# EAGLE design absolute_position (EAGLE 6.5.0)
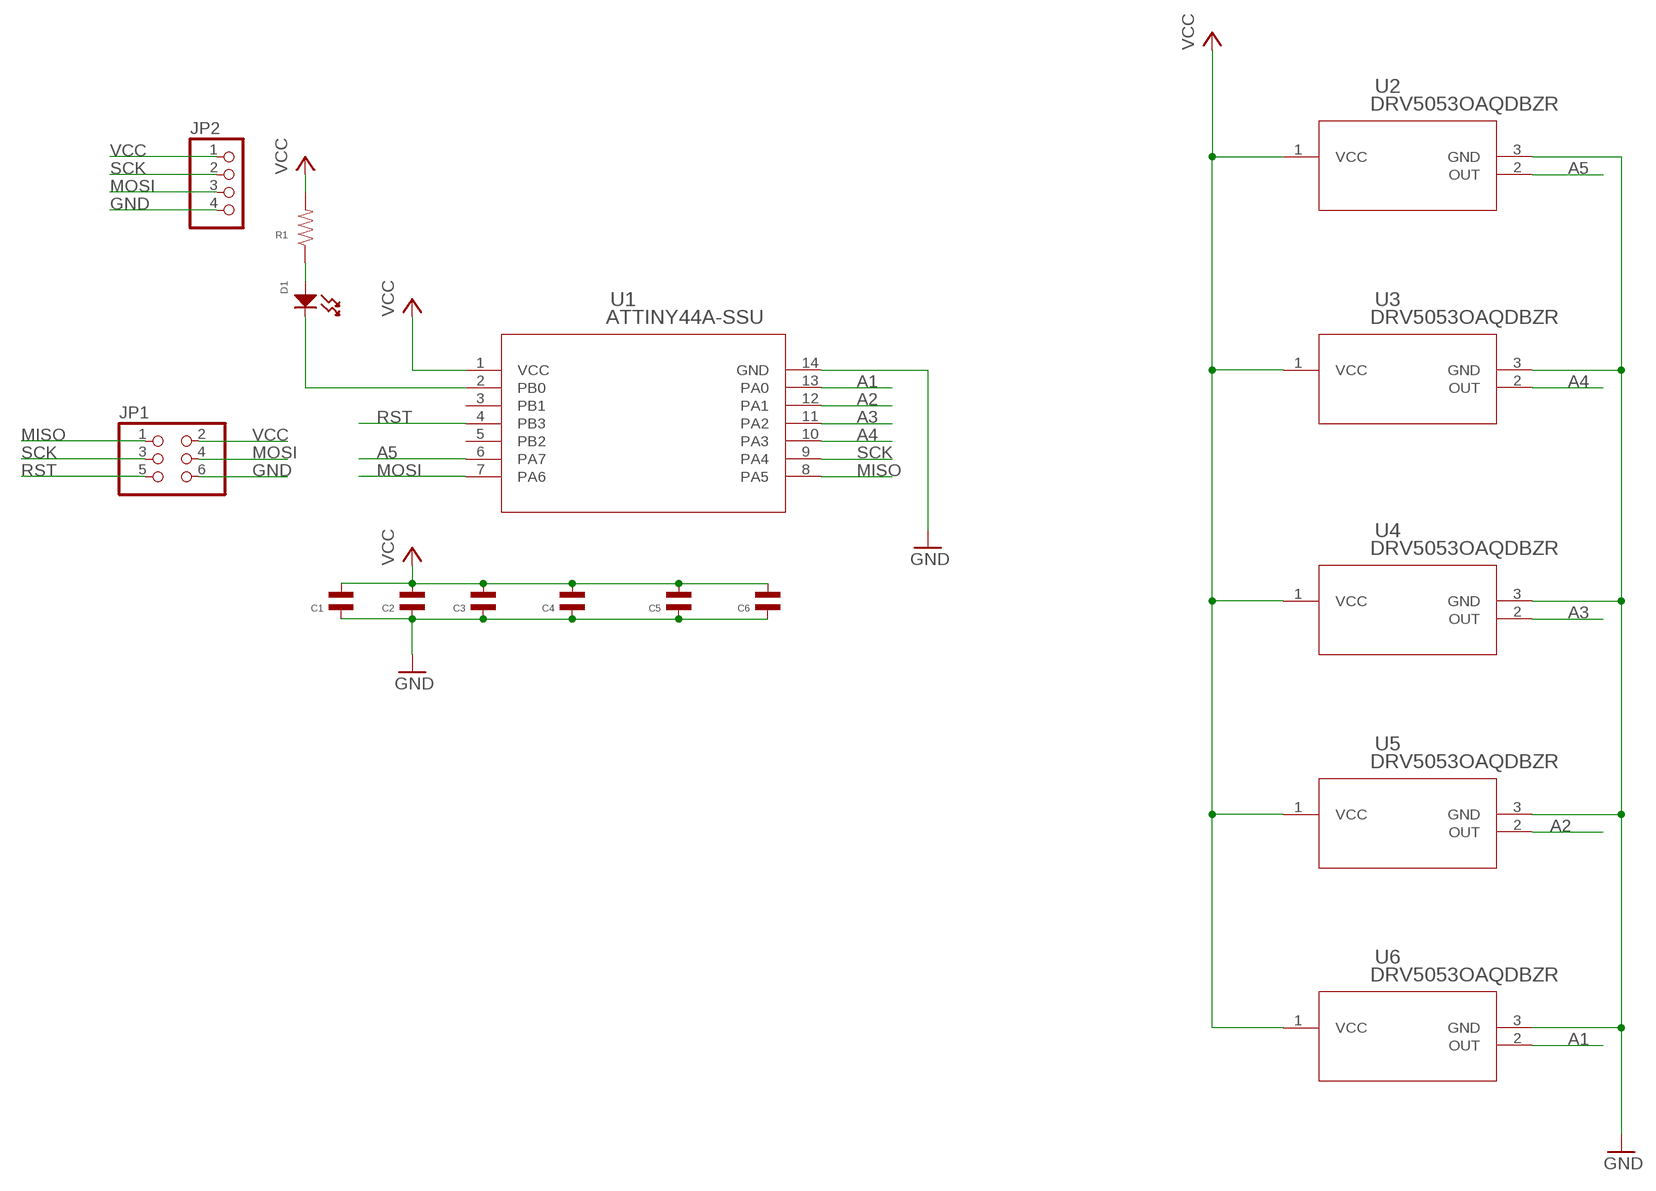
[diagram p0: schematic, sheet 1]

## Parts
C1  CAPACITOR_NP_0603  [C0603]
C2  CAPACITOR_NP_0603  [C0603]
C3  CAPACITOR_NP_0603  [C0603]
C4  CAPACITOR_NP_0603  [C0603]
C5  CAPACITOR_NP_0603  [C0603]
C6  CAPACITOR_NP_0603  [C0603]
D1  LED_SINGLE-0603  [LED0603]
JP1  PINHD-2X3  [2X03]
JP2  PINHD-1X4  [1X04]
R1  RESISTOR_0603  [R0603]
U1  ATTINY44A-SSU  [14S1]
U2  DRV5053OAQDBZR  [DBZ3]
U3  DRV5053OAQDBZR  [DBZ3]
U4  DRV5053OAQDBZR  [DBZ3]
U5  DRV5053OAQDBZR  [DBZ3]
U6  DRV5053OAQDBZR  [DBZ3]

## Nets
A1: U1.13(PA0) U6.2(OUT)
A2: U1.12(PA1) U5.2(OUT)
A3: U1.11(PA2) U4.2(OUT)
A4: U1.10(PA3) U3.2(OUT)
A5: U1.6(PA7) U2.2(OUT)
GND: C1.P$1 C2.P$1 C3.P$1 C4.P$1 C5.P$1 C6.P$1 JP1.6 JP2.4 U1.14(GND) U2.3(GND) U3.3(GND) U4.3(GND) U5.3(GND) U6.3(GND)
MISO: JP1.1 U1.8(PA5)
MOSI: JP1.4 JP2.3 U1.7(PA6)
N$1: D1.ANODE R1.P$1
N$2: D1.CATHODE U1.2(PB0)
RST: JP1.5 U1.4(PB3)
SCK: JP1.3 JP2.2 U1.9(PA4)
VCC: C1.P$2 C2.P$2 C3.P$2 C4.P$2 C5.P$2 C6.P$2 JP1.2 JP2.1 R1.P$2 U1.1(VCC) U2.1(VCC) U3.1(VCC) U4.1(VCC) U5.1(VCC) U6.1(VCC)
Unconnected: U1.3(PB1) U1.5(PB2)

## Library data of the parts
C1-C6 = mfpassives:CAPACITOR_NP: Library: MF_Passives Description: Device for Non-Polarized Capacitors. Manufacture part number (MPN) can be added via Attributes. Check https://factory.macrofab.com/parts for the house parts list.; POPULATE: 1
D1 = mfleds:LED_SINGLE: Library: MF_LEDs Description: Device for Single LED Packages. Manufacture part number (MFG#) can be added via Attributes.; HOUSEPART: NO; POPULATE: 1
JP1 = pinhead:PINHD-2X3: PIN HEADER
JP2 = pinhead:PINHD-1X4: PIN HEADER
R1 = mfpassives:RESISTOR: Library: MF_Passives Description: Device for Resistors. Manufacture part number (MPN), Voltage, Tolerance, and Wattage Rating can be added via Attributes. Check https://factory.macrofab.com/parts for the house parts list.; POPULATE: 1
U1 = absolute_position:ATTINY44A-SSU; MANUFACTURER_PART_NUMBER: ATTINY44ASSU; VENDOR: Atmel
U2-U6 = absolute_position:DRV5053OAQDBZR; MANUFACTURER_PART_NUMBER: DRV5053OAQDBZR; VENDOR: Texas Instruments

## Board
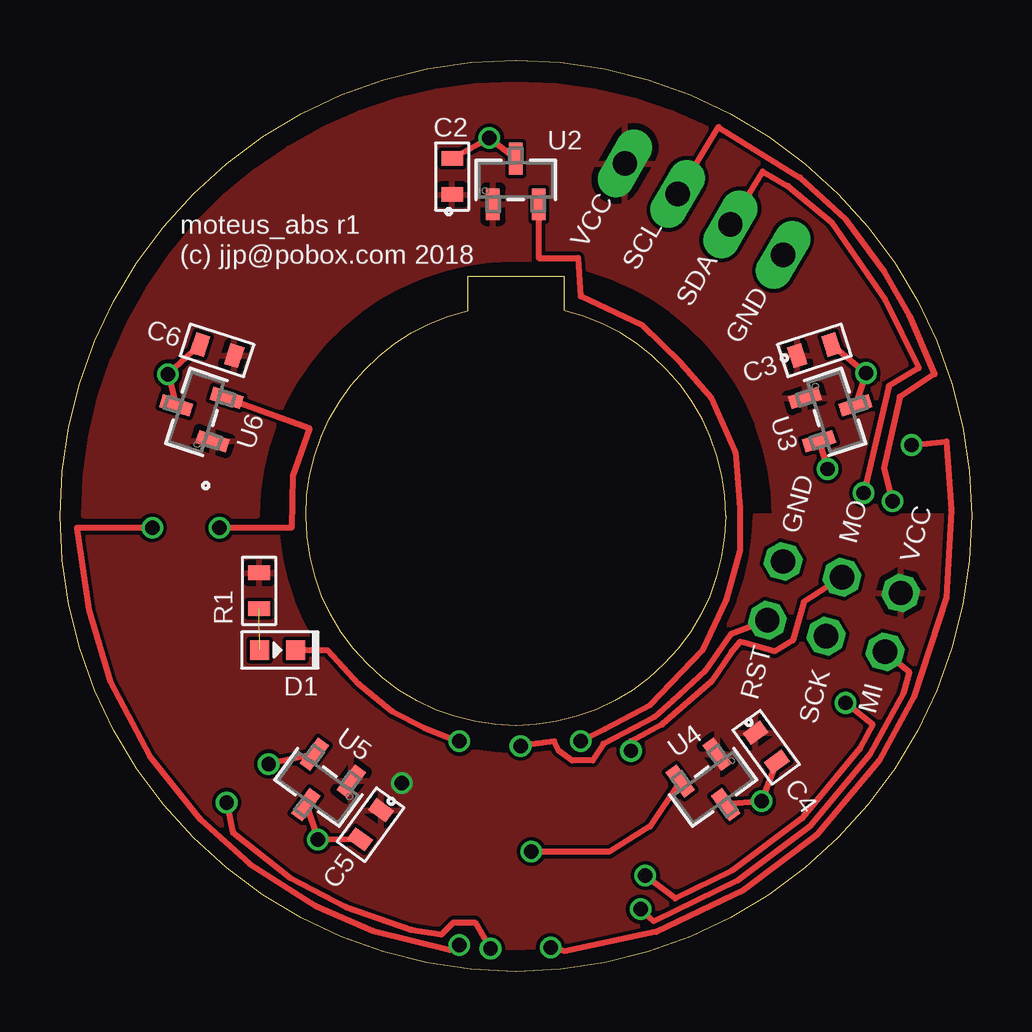
[diagram p1: board, top side]
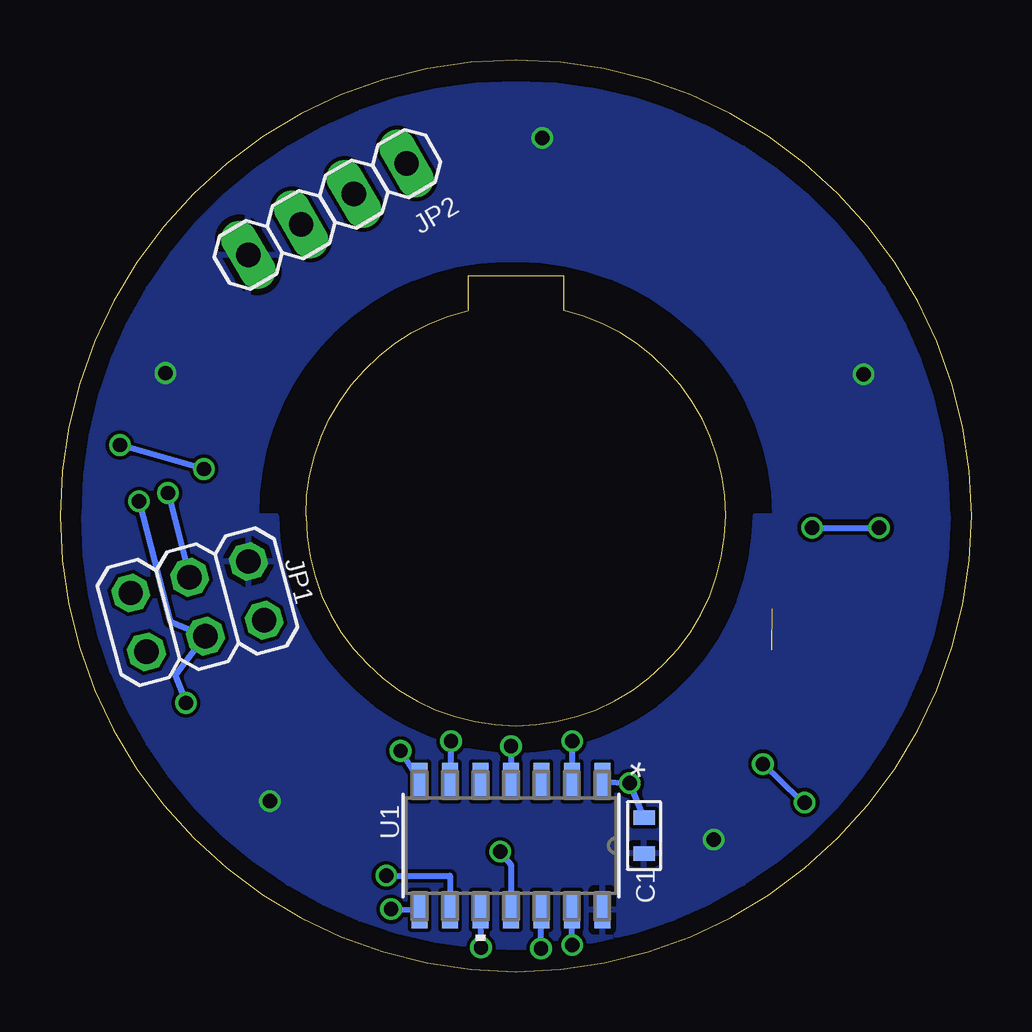
[diagram p2: board, bottom side, seen from below]

Size 38 x 38 mm. Coordinates in mm from the lower left corner, seen from the top.
Outline: 0,19 arc-180 38,19 arc-180 0,19
Outline: 27.75,19 arc-180 10.25,19 arc-77 17,27.55 17,29 21,29 21,27.55 arc-77 27.75,19
Copper layers (1*16): Top 0.035559375mm / dielectric 1.6mm / Bottom 0.035559375mm
Design rules "oshpark-2layer *": minimum track width 6mil, minimum drill 10mil, track to track 6mil, track to pad 6mil, pad to pad 6mil, via to via 6mil, smd to smd 6mil, copper to edge 15mil, drill to drill 6mil, minimum pad ring 5mil, minimum via ring 5mil, stop-mask expansion 2.5mil, vias tented up to drill 30mil, thermal gap 10mil

### Footprints (pad centres in the part's own frame; a part is rotated, then mirrored left to right if it is on the bottom)
C0603 = smd 0.6 x 0.9: P$1 -0.75,0; P$2 0.75,0
LED0603 = smd 0.8 x 0.8: ANODE 0.75,0; CATHODE -0.75,0
2X03 = drill 1.016 octagon: 1 -2.54,-1.27; 2 -2.54,1.27; 3 0,-1.27; 4 0,1.27; 5 2.54,-1.27; 6 2.54,1.27
1X04 = drill 1.016 long: 1 -3.81,0; 2 -1.27,0; 3 1.27,0; 4 3.81,0
R0603 = smd 0.6 x 0.9: P$1 -0.75,0; P$2 0.75,0
14S1 = smd 1.549 x 0.66: 1 -2.68,3.81; 2 -2.68,2.54; 3 -2.68,1.27; 4 -2.68,0; 5 -2.68,-1.27; 6 -2.68,-2.54; 7 -2.68,-3.81; 8 2.68,-3.81; 9 2.68,-2.54; 10 2.68,-1.27; 11 2.68,0; 12 2.68,1.27; 13 2.68,2.54; 14 2.68,3.81
DBZ3 = smd 0.559 x 1.321: 1 -0.95,-1.016; 2 0.95,-1.016; 3 0,0.883

### Placement (x,y rotation side)
C1  13.65,5.67 90 bottom
C2  16.35,33.14 270 top
C3  31.45,25.9 198 top
C4  29.44,9.35 126 top
C5  12.95,6.12 54 top
C6  6.55,25.9 342 top
D1  9.07,13.4 180 top
JP1  32.27,15.21 15 bottom
JP2  26.85,31.78 210 bottom
R1  8.3,15.87 90 top
U1  19.2,5.25 270 bottom
U2  19,33 0 top
U3  32.31,23.33 288 top
U4  27.23,7.67 216 top
U5  10.77,7.67 144 top
U6  5.69,23.33 72 top

### Tracks (layer width: path | path; a pad name or v marks a point on that pad's centre or on a via)
A1  (via drill 0.6)
  Top 0.254: U6.2 10.4,22.65 9.7,20.65 9.65,18.5 v6.65,18.5 | v3.85,18.5 0.7,18.5 1.2,15.1 2.1,12.1 3.75,8.95 5.85,6.35 7.9,4.5 10.65,2.75 13.05,1.7 16.25,0.9 v16.65,1.1
  Bottom 0.254: v6.65,18.5 v3.85,18.5 | v16.65,1.1 U1.13
A2  (via drill 0.6)
  Top 0.254: U5.2 v8.7,8.65 | v6.95,7.05 7.2,5.8 9.6,3.9 11.9,2.7 14.65,1.75 15.9,1.55 16.4,2.05 17.3,2.05 v17.95,0.95
  Bottom 0.254: v8.7,8.65 7.2,7.2 v6.95,7.05 | v17.95,0.95 U1.12
A3  (via drill 0.6)
  Top 0.254: U4.2 24.6,6.05 22.9,5 v19.65,5
  Bottom 0.254: v19.65,5 19.2,4.45 U1.11
A4  (via drill 0.6)
  Top 0.254: U3.2 v32,20.95 | v35.5,21.95 36.95,22.1 37.15,19.25 36.95,15.6 35.6,11.45 34.15,8.8 31.55,5.7 28.5,3.4 24.85,1.65 21.05,0.85 v20.45,1
  Bottom 0.254: v32,20.95 v35.5,21.95 | v20.45,1 U1.10
A5  (via drill 0.6)
  Top 0.254: U2.2 19.95,29.75 21.6,29.75 21.7,28.15 24.25,26.95 25.85,25.4 27.15,23.9 28.15,21.65 28.35,19.3 28.35,17.55 27.75,15.45 26.8,13.4 24.6,11.1 22.7,10.1 v21.7,9.6
  Bottom 0.254: v21.7,9.6 U1.6
GND  (via drill 0.6)
  Top 0.254: U5.3 v10.75,5.5 C5.P$1 | U6.3 v4.5,24.9 C6.P$1 | C2.P$1 v17.9,34.75 U2.3 | C3.P$1 v33.6,24.95 U3.3 | C4.P$1 v29.25,7.1 U4.3
  pour Bottom: 19,37 arc-90 37,19 29.8,19 arc90 19.55,29.7 19,29.7
  pour Bottom: 1,19 arc90 19,1 19,9 arc-90 9,19
  pour Bottom: 19,1 arc90 37,19 29,19 arc-90 19,9
  pour Bottom: 1,19 arc-90 19,37 19,29.7 18.9,29.7 arc90 8.2,19
MISO  (via drill 0.6)
  Top 0.254: JP1.1 35.4,12.5 35.15,11.6 33.75,9.05 31.25,6.05 28.25,3.8 24.75,2.1 v24.2,2.6
  Bottom 0.254: v24.2,2.6 U1.8
MOSI  (via drill 0.6)
  Top 0.254: JP2.3 29.3,33.35 30.35,32.75 32.15,31.25 34.4,28 35.8,25.15 34.55,24.4 v33.5,19.95 | JP1.4 31,15.4 30.55,13.8 29.8,13.35 28.55,13.7 28.35,13.75 28,13.35 27.15,12.1 25.1,10.3 23.8,9.6 v23.8,9.2
  Bottom 0.254: v33.5,19.95 JP1.4 | v23.8,9.2 U1.7
N$1  (1 unrouted)
N$2  (via drill 0.6)
  Top 0.254: D1.CATHODE 11.15,13.4 12.45,12 13.85,10.85 15.2,10.15 16.35,9.7 v16.65,9.6
  Bottom 0.254: v16.65,9.6 U1.2
RST  (via drill 0.6)
  Top 0.254: JP1.5 27.95,14.05 26.9,12.55 25.55,11.3 24.75,10.6 22.65,9.5 22.2,8.8 21.35,8.8 20.8,9.2 20.6,9.6 v19.2,9.4
  Bottom 0.254: v19.2,9.4 U1.4
SCK  (via drill 0.6)
  Top 0.254: JP2.2 27.45,35.2 30.85,33.1 32.75,31.35 34.35,29.2 35.4,27.35 36.45,24.9 35,23.95 34.35,21 v34.7,19.6 | v24.4,4 25.65,3.05 28,4.2 30.95,6.4 33.35,9.3 33.88,10.3 v32.75,11.2
  Bottom 0.254: v34.7,19.6 33.4,14.6 JP1.3 33.2,12.35 v32.75,11.2 | v24.4,4 21.75,4 U1.9
VCC  (via drill 0.6)
  Bottom 0.254: U1.1 v14.25,7.85 C1.P$2
  pour Top: 1,19 arc-90 19,37 19,29.7 18.9,29.7 arc90 8.2,19
  pour Top: 19,37 arc-90 37,19 29.8,19 arc90 19.1,29.7 19,29.7
  pour Top: 37,19 arc-90 19,1 19,9 arc90 29,19
  pour Top: 19,1 arc-90 1,19 9,19 arc90 19,9

### Text on the board
tNames: VCC | moteus_abs r1 | SCL | (c) jjp@pobox.com 2018 | SDA | GND | GND | MO | VCC | RST | SCK | MI